# Altium schematic sheet Project_PCBTA.SchDoc
size A4
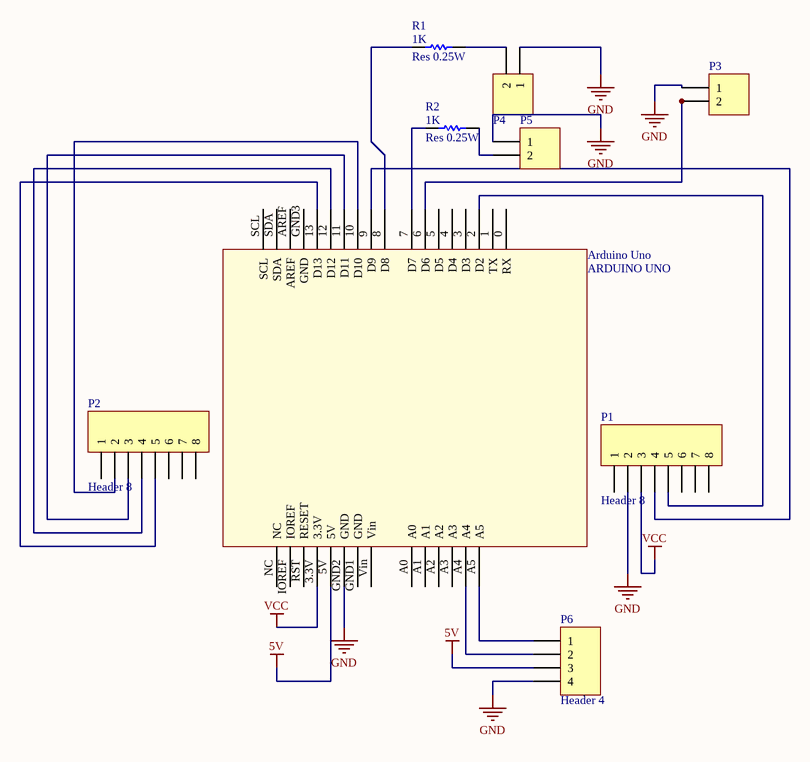
[diagram p0: Project_PCBTA.SchDoc]

## Parts
Arduino_Uno  ARDUINO UNO  [ARDUINO UNO]
P1  Header 8  [HDR1X8]
P2  Header 8  [HDR1X8]
P3  Header 2  [My_1X02]  (value not drawn)
P4  Header 2  [My_1X02]  (value not drawn)
P5  Header 2  [My_1X02]  (value not drawn)
P6  Header 4  [HDR1X4]
R1  Res 0.25W  [Res 0.25]
R2  Res 0.25W  [Res 0.25]

## Nets
5V: Arduino_Uno.5V P6.3
GND: Arduino_Uno.GND2(GND) P1.2 P3.1 P4.1 P5.1 P6.4
VCC: Arduino_Uno.3.3V P1.3
NetArduino_Uno_2: Arduino_Uno.2(D2) P1.5
NetArduino_Uno_6: Arduino_Uno.6(D6) P3.2
NetArduino_Uno_7: Arduino_Uno.7(D7) R2.1
NetArduino_Uno_8: Arduino_Uno.8(D8) R1.1
NetArduino_Uno_9: Arduino_Uno.9(D9) P1.4
NetArduino_Uno_10: Arduino_Uno.10(D10) P2.2
NetArduino_Uno_11: Arduino_Uno.11(D11) P2.3
NetArduino_Uno_12: Arduino_Uno.12(D12) P2.4
NetArduino_Uno_13: Arduino_Uno.13(D13) P2.5
NetArduino_Uno_A4: Arduino_Uno.A4 P6.2
NetArduino_Uno_A5: Arduino_Uno.A5 P6.1
NetP4_2: P4.2 R1.2
NetP5_2: P5.2 R2.2

Not connected (* = marked no-connect by the designer): Arduino_Uno 0(RX) 1(TX) 3(D3) 4(D4) 5(D5) A0 A1 A2 A3 AREF GND1(GND) GND3(GND) IOREF NC RST(RESET) SCL SDA Vin; P1 1 6 7 8; P2 1 6 7 8

## Notes on the sheet
- (in symbol Res 0.25W) 1K

## Library data of the parts
P1 P2 = Header 8: Header, 8-Pin; LatestRevisionDate: 17-Jul-2002; LatestRevisionNote: Re-released for DXP Platform.; Publisher: Altium Limited
P3-P5 = Header 2: Header, 2-Pin; LatestRevisionDate: 17-Jul-2002; LatestRevisionNote: Re-released for DXP Platform.; Publisher: Altium Limited
P6 = Header 4: Header, 4-Pin; LatestRevisionDate: 17-Jul-2002; LatestRevisionNote: Re-released for DXP Platform.; Publisher: Altium Limited